# EAGLE board 24x16_RGB_ATXMega_Wifi_BBuck (EAGLE 6.5.0)
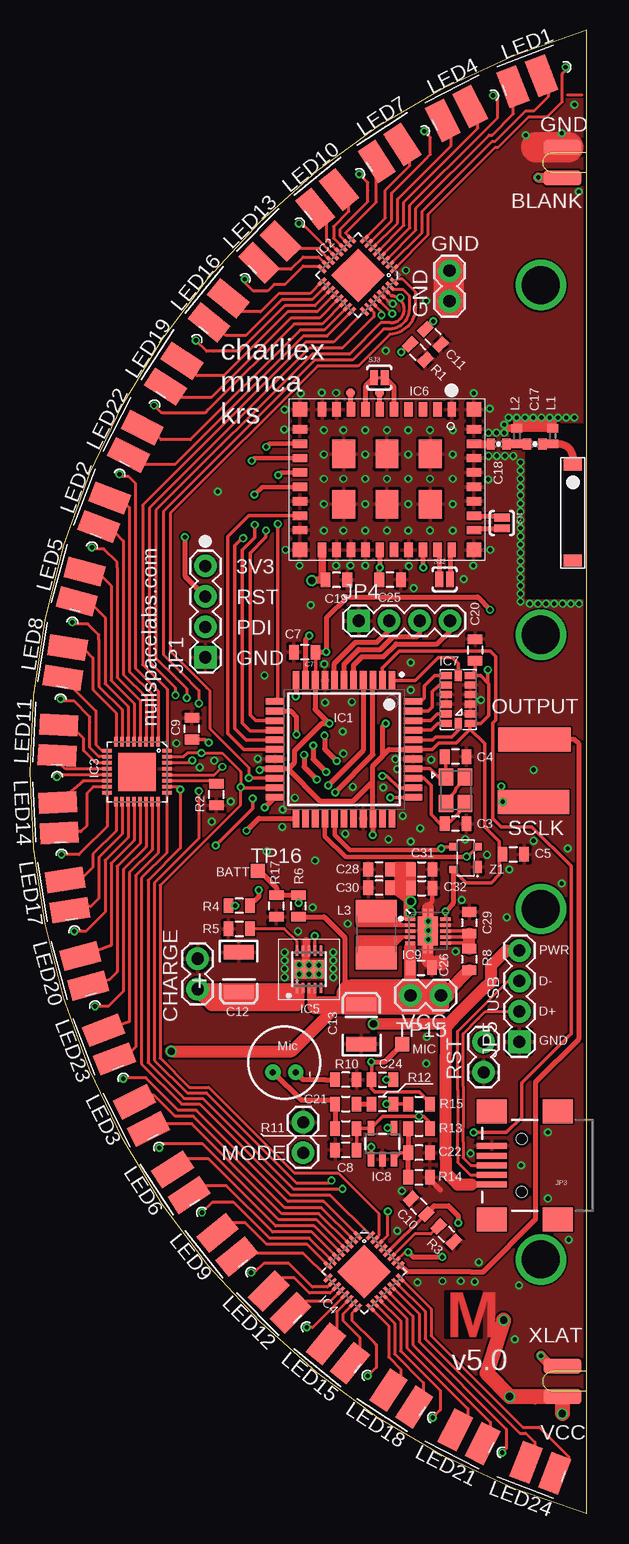
[diagram p8: board, top side]
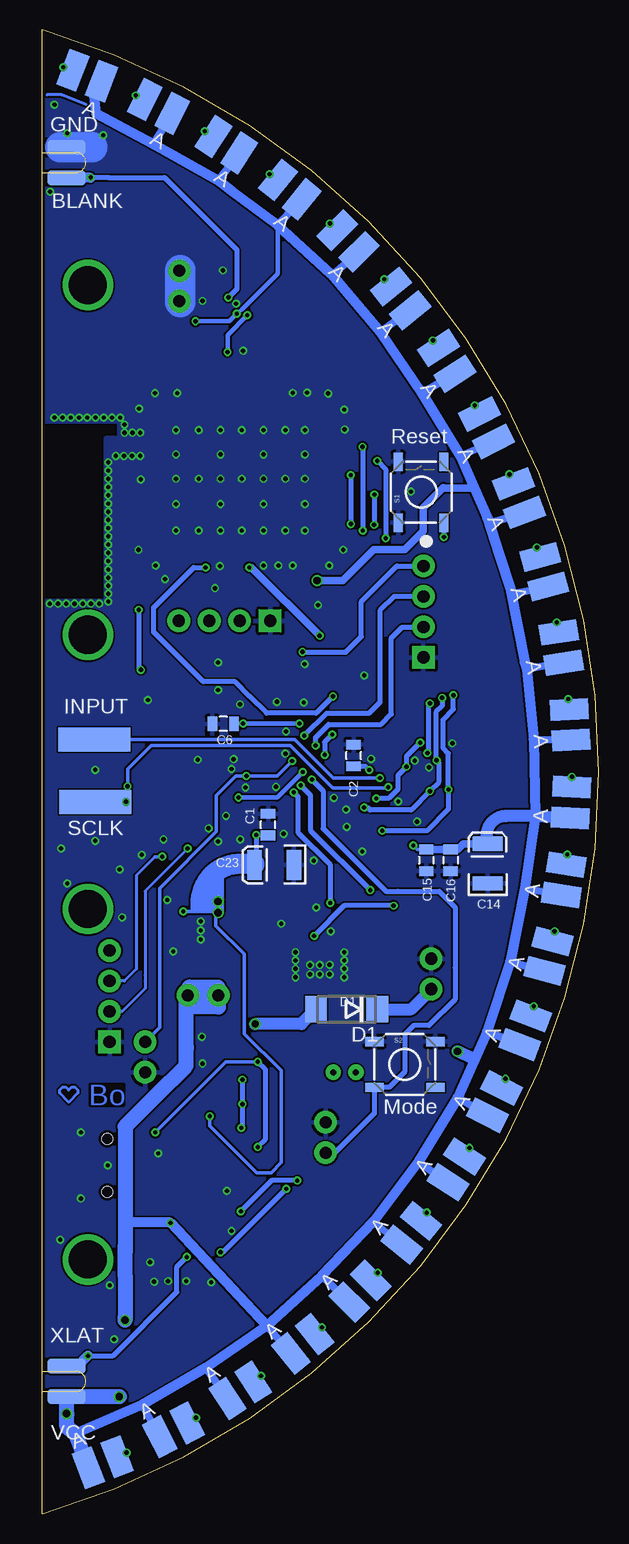
[diagram p9: board, bottom side, seen from below]

Size 46.39 x 123.7 mm. Coordinates in mm from the lower left corner, seen from the top.
Outline: 46.39,0 arc-147 46.39,123.7 46.39,0
Copper layers (1*16): Top 0.035mm / dielectric 1.5mm / Bottom 0.035mm
Design rules "ITEADstudio_DRC": minimum track width 6mil, minimum drill 12mil, track to track 6mil, track to pad 6mil, pad to pad 6mil, via to via 6mil, smd to smd 0mil, copper to edge 10mil, drill to drill 10mil, minimum pad ring 10mil, minimum via ring 6mil, stop-mask expansion 2mil, vias tented up to drill 100mil, thermal gap 10mil

## Footprints (pad centres in the part's own frame; a part is rotated, then mirrored left to right if it is on the bottom)
AT8010 = smd 1 x 1.5: P$1 4,0; P$2 -4,0
0805 = smd 0.8 x 1.2: 1 -0.9,0; 2 0.9,0
EIA3528 = smd 1.2 x 2.5: A 1.65,0; C -1.65,0
0402-CAP = smd 0.7 x 0.9: 1 -0.65,0; 2 0.65,0
1X02 = drill 1.016 pad 1.88: 1 0,0; 2 2.54,0
DO214AA = smd 1.8 x 2.2: A 2.55,0; C -2.55,0
NONOLITH_TQFP-44 = smd 1.55 x 0.55: 1 -5.75,4; 2 -5.75,3.2; 3 -5.75,2.4; 4 -5.75,1.6; 5 -5.75,0.8; 6 -5.75,0; 7 -5.75,-0.8; 8 -5.75,-1.6; 9 -5.75,-2.4; 10 -5.75,-3.2; 11 -5.75,-4; 23 5.75,-4; 24 5.75,-3.2; 25 5.75,-2.4; 26 5.75,-1.6; 27 5.75,-0.8; 28 5.75,0; 29 5.75,0.8; 30 5.75,1.6; 31 5.75,2.4; 32 5.75,3.2; 33 5.75,4 | smd 0.55 x 1.55: 12 -4,-5.75; 13 -3.2,-5.75; 14 -2.4,-5.75; 15 -1.6,-5.75; 16 -0.8,-5.75; 17 0,-5.75; 18 0.8,-5.75; 19 1.6,-5.75; 20 2.4,-5.75; 21 3.2,-5.75; 22 4,-5.75; 34 4,5.75; 35 3.2,5.75; 36 2.4,5.75; 37 1.6,5.75; 38 0.8,5.75; 39 0,5.75; 40 -0.8,5.75; 41 -1.6,5.75; 42 -2.4,5.75; 43 -3.2,5.75; 44 -4,5.75
QFN32_XLP = smd 0.285 x 0.8: 1 -1.75,-2.5; 2 -1.25,-2.5; 3 -0.75,-2.5; 4 -0.25,-2.5; 5 0.25,-2.5; 6 0.75,-2.5; 7 1.25,-2.5; 8 1.75,-2.5; 17 1.75,2.5; 18 1.25,2.5; 19 0.75,2.5; 20 0.25,2.5; 21 -0.25,2.5; 22 -0.75,2.5; 23 -1.25,2.5; 24 -1.75,2.5 | smd 0.8 x 0.285: 9 2.5,-1.75; 10 2.5,-1.25; 11 2.5,-0.75; 12 2.5,-0.25; 13 2.5,0.25; 14 2.5,0.75; 15 2.5,1.25; 16 2.5,1.75; 25 -2.5,1.75; 26 -2.5,1.25; 27 -2.5,0.75; 28 -2.5,0.25; 29 -2.5,-0.25; 30 -2.5,-0.75; 31 -2.5,-1.25; 32 -2.5,-1.75 | smd 3.15 x 3.15: EP 0,0
DFN10_3X3 = smd 0.3 x 0.85: 1 -1,-1.55; 2 -0.5,-1.55; 3 0,-1.55; 4 0.5,-1.55; 5 1,-1.55; 6 1,1.55; 7 0.5,1.55; 8 0,1.55; 9 -0.5,1.55; 10 -1,1.55 | smd 2.48 x 1.55: EXP 0,0
CC3000 = smd 1.2 x 0.7: P$1 0.9,13.55; P$2 0.9,12.35; P$3 0.9,11.15; P$4 0.9,9.95; P$5 0.9,8.75; P$6 0.9,7.55; P$7 0.9,6.35; P$8 0.9,5.15; P$9 0.9,3.95; P$10 0.9,2.75; P$19 12.6,2.75; P$20 12.6,3.95; P$21 12.6,5.15; P$22 12.6,6.35; P$23 12.6,7.55; P$24 12.6,8.75; P$25 12.6,9.95; P$26 12.6,11.15; P$27 12.6,12.35; P$28 12.6,13.55 | smd 0.7 x 1.2: P$11 2.55,0.9; P$12 3.75,0.9; P$13 4.95,0.9; P$14 6.15,0.9; P$15 7.35,0.9; P$16 8.55,0.9; P$17 9.75,0.9; P$18 10.95,0.9; P$29 10.95,15.4; P$30 9.75,15.4; P$31 8.55,15.4; P$32 7.35,15.4; P$33 6.15,15.4; P$34 4.95,15.4; P$35 3.75,15.4; P$36 2.55,15.4 | smd 2.4 x 1.9: P$37 4.6,11.75; P$38 4.6,8.15; P$39 4.6,4.55; P$40 8.8,11.75; P$41 8.8,8.15; P$42 8.8,4.55 | smd 1.2 x 1.2: P$43 0.9,15.4; P$44 0.9,0.9; P$45 12.6,0.9; P$46 12.6,15.4
LGA-14 = smd 0.6 x 0.9: 1 -2,-1; 2 -1.2,-1; 3 -0.4,-1; 4 0.4,-1; 5 1.2,-1; 6 2,-1; 8 2,1; 9 1.2,1; 10 0.4,1; 11 -0.4,1; 12 -1.2,1; 13 -2,1 | smd 0.9 x 0.6: 7 2,0; 14 -2,0
SOT23-5 = smd 0.55 x 1.2: 1 -0.95,-1.3; 2 0,-1.3; 3 0.95,-1.3; 4 0.95,1.3; 5 -0.95,1.3
QFN_10_PAD = smd 0.297 x 0.85: 1 -1,-1.475; 2 -0.5,-1.475; 3 0,-1.475; 4 0.5,-1.475; 5 1,-1.475; 6 1,1.475; 7 0.5,1.475; 8 0,1.475; 9 -0.5,1.475; 10 -1,1.475 | smd 2.4 x 1.65: PAD@1 0,0 | smd 0.7 x 0.28: PAD@2 -1.5,0.25; PAD@3 -1.5,-0.25; PAD@4 1.5,0.25; PAD@5 1.5,-0.25
1X04 = drill 1.016 pad 1.88 square: 1 0,0 | drill 1.016 pad 1.88: 2 2.54,0; 3 5.08,0; 4 7.62,0
USB-MINIB = smd 2.5 x 0.5: D+ 2.5,0; D- 2.5,0.8; GND 2.5,-1.6; ID 2.5,-0.8; VBUS 2.5,1.6 | smd 2.5 x 2: MTN1 -3,4.5; MTN2 2.5,4.5; MTN3 -3,-4.5; MTN4 2.5,-4.5 | hole 0.9: 0,2.2; 0,-2.2
C0402 = smd 0.7 x 0.9: 1 -0.65,0; 2 0.65,0
L1812 = smd 1.9 x 3.4: 1 -1.95,0; 2 1.95,0
LED5MM_RGB_EDGE = smd 1.75 x 3.175 bottom: A -0.585,-1.6; B 1.971,-1.6 | smd 1.75 x 3.175: G 0.693,-1.6; R -1.863,-1.6
MIC-6MM = drill 0.5 pad 1.27: 1 -0.8,0.95; 2 -0.8,-0.95
TACTILE_SWITCH_SMD = smd 1.524 x 0.762: 1 -2.54,1.905; 2 2.54,1.905; 3 -2.54,-1.905; 4 2.54,-1.905
SJ_2S-NO = smd 0.635 x 1.27: 1 -0.45,0; 2 0.45,0
SLOT = smd 3.175 x 1.27: P$1 2.032,1.27; P$2 2.032,-1.27 | smd 3.175 x 1.27 bottom: P$3 2.032,1.27; P$4 2.032,-1.27
TP20SQ = smd 2 x 2: TP 0,0
SPARKFUN_PAD.03X.03 = smd 0.762 x 0.762: P$1 0,0
TP12SQ = smd 1.2 x 1.2: TP 0,0
NX3225GA = smd 1.4 x 1.2: 1 -1.1,-0.8; 2 1.1,-0.8; 3 1.1,0.8; 4 -1.1,0.8
SOT143B = smd 1 x 0.7: 1 -0.75,-1 | smd 0.6 x 0.7: 2 0.95,-1; 3 0.95,1; 4 -0.95,1

## Placement (x,y rotation side)
ANT  AT8010  [AT8010]  45.24,83.46 90 top
C1  .1uF  [0805]  27.57,57.45 90 bottom
C2  .1uF  [0805]  20.43,63.22 90 bottom
C3  10pF  [0805]  35.46,57.53 180 top
C4  10pF  [0805]  35.46,63.12 180 top
C5  .1uF  [0805]  40.28,54.98 0 top
C6  .1uF  [0805]  31.3,65.86 180 bottom
C7  .1uF  [0805]  22.89,71.83 180 top
C8  0.1uF  [0805]  26.32,30.33 180 top
C9  .1uF  [0805]  13.49,65.46 90 top
C10  .1uF  [0805]  32.39,25.63 135 top
C11  .1uF  [0805]  33.58,98.13 315 top
C12  4.7uF  [EIA3528]  17.41,45.16 270 top
C13  4.7uF  [EIA3528]  27.62,40.82 90 top
C14  47uF  [EIA3528]  9.28,54.2 90 bottom
C15  10uF  [0805]  14.38,54.48 270 bottom
C16  1uF  [0805]  12.35,54.48 270 bottom
C17  2.2pF  [0402-CAP]  42.07,89.18 180 top
C18  10pF  [0402-CAP]  39.05,89.18 180 top
C19  1uF  [0805]  25.53,77.85 180 top
C20  0.1uF  [0805]  37.09,72.01 270 top
C21  4.7uF  [0805]  26.32,34.16 0 top
C22  1uF  [0805]  32.42,30.1 180 top
C23  47uF  [EIA3528]  27.06,54.1 180 bottom
C24  12pF  [0805]  29.37,36.19 0 top
C25  1uF  [0805]  30,77.88 180 top
C26  10uF  [0805]  32.59,45.52 0 top
C28  10uF  [0805]  29.09,53.72 180 top
C29  0.1  [0805]  36.61,49.28 270 top
C30  10uF  [0805]  29.09,52.2 180 top
C31  12pF  [0805]  32.65,53.72 0 top
C32  1uF  [0805]  32.65,52.17 0 top
CHARGE  [1X02]  13.98,46.28 270 top
D1  SSB44-E3/52T  [DO214AA]  21.01,42.06 180 bottom
GND  [1X02]  34.96,101.09 90 top
IC1  [NONOLITH_TQFP-44]  26.17,63.73 270 top
IC2  TLC5947XLP  [QFN32_XLP]  27.34,103.25 135 top
IC3  TLC5947XLP  [QFN32_XLP]  8.92,61.85 180 top
IC4  TLC5947XLP  [QFN32_XLP]  27.84,20.19 225 top
IC5  MCP73123  [DFN10_3X3]  23.25,45.39 0 top
IC6  CC3000  [CC3000]  21.6,92.96 270 top
IC7  MMA7455L  [LGA-14]  35.69,67.89 90 top
IC8  OPA344  [SOT23-5]  29.37,30.86 0 top
IC9  TPS6300X  [QFN_10_PAD]  33.15,48.59 270 top
JP1  [1X04]  14.61,71.4 90 top
JP3  USBSMD  [USB-MINIB]  40.98,29.06 180 top
JP4  [1X04]  27.39,74.45 0 top
JP5  [1X04]  40.77,39.34 90 top
L1  NL  [C0402]  43.57,89.84 270 top
L2  2.2nH  [C0402]  40.57,89.84 270 top
L3  [L1812]  28.86,48.29 90 top
LED1  GM1WA55311A5MM_RGB_EDGE  [LED5MM_RGB_EDGE]  41.41,121.13 21 top
LED2  GM1WA55311A5MM_RGB_EDGE  [LED5MM_RGB_EDGE]  4.91,84.6 69 top
LED3  GM1WA55311A5MM_RGB_EDGE  [LED5MM_RGB_EDGE]  7.59,33.02 117 top
LED4  GM1WA55311A5MM_RGB_EDGE  [LED5MM_RGB_EDGE]  35.34,118.43 27 top
LED5  GM1WA55311A5MM_RGB_EDGE  [LED5MM_RGB_EDGE]  2.83,78.28 75 top
LED6  GM1WA55311A5MM_RGB_EDGE  [LED5MM_RGB_EDGE]  10.91,27.26 123 top
LED7  GM1WA55311A5MM_RGB_EDGE  [LED5MM_RGB_EDGE]  29.58,115.11 33 top
LED8  GM1WA55311A5MM_RGB_EDGE  [LED5MM_RGB_EDGE]  1.45,71.78 81 top
LED9  GM1WA55311A5MM_RGB_EDGE  [LED5MM_RGB_EDGE]  14.82,21.89 129 top
LED10  GM1WA55311A5MM_RGB_EDGE  [LED5MM_RGB_EDGE]  24.21,111.2 39 top
LED11  GM1WA55311A5MM_RGB_EDGE  [LED5MM_RGB_EDGE]  0.75,65.17 87 top
LED12  GM1WA55311A5MM_RGB_EDGE  [LED5MM_RGB_EDGE]  19.26,16.95 135 top
LED13  GM1WA55311A5MM_RGB_EDGE  [LED5MM_RGB_EDGE]  19.26,106.75 45 top
LED14  GM1WA55311A5MM_RGB_EDGE  [LED5MM_RGB_EDGE]  0.75,58.53 93 top
LED15  GM1WA55311A5MM_RGB_EDGE  [LED5MM_RGB_EDGE]  24.21,12.5 141 top
LED16  GM1WA55311A5MM_RGB_EDGE  [LED5MM_RGB_EDGE]  14.84,101.79 51 top
LED17  GM1WA55311A5MM_RGB_EDGE  [LED5MM_RGB_EDGE]  1.45,51.92 99 top
LED18  GM1WA55311A5MM_RGB_EDGE  [LED5MM_RGB_EDGE]  29.58,8.59 147 top
LED19  GM1WA55311A5MM_RGB_EDGE  [LED5MM_RGB_EDGE]  10.96,96.41 57 top
LED20  GM1WA55311A5MM_RGB_EDGE  [LED5MM_RGB_EDGE]  2.83,45.42 105 top
LED21  GM1WA55311A5MM_RGB_EDGE  [LED5MM_RGB_EDGE]  35.34,5.27 153 top
LED22  GM1WA55311A5MM_RGB_EDGE  [LED5MM_RGB_EDGE]  7.61,90.65 63 top
LED23  GM1WA55311A5MM_RGB_EDGE  [LED5MM_RGB_EDGE]  4.88,39.09 111 top
LED24  GM1WA55311A5MM_RGB_EDGE  [LED5MM_RGB_EDGE]  41.41,2.57 159 top
MIC1  MIC6MM  [MIC-6MM]  21.19,37.62 90 top
MODE  [1X02]  22.76,32.64 270 top
R1  20K  [0805]  32.32,96.85 135 top
R2  20K  [0805]  15.53,59.97 90 top
R3  20K  [0805]  34.69,23.32 135 top
R4  1K  [0805]  17.43,50.7 180 top
R5  1K  [0805]  17.43,48.77 0 top
R6  100K  [0805]  22.36,50.67 90 top
R8  100R  [0805]  36.61,46.23 270 top
R10  4.7k  [0805]  26.32,36.19 180 top
R11  2.2k  [0805]  26.32,32.13 0 top
R12  10k  [0805]  29.37,34.16 180 top
R13  10k  [0805]  32.42,32.13 0 top
R14  10k  [0805]  32.42,28.07 0 top
R15  1M  [0805]  32.42,34.16 0 top
R17  100K  [0805]  20.53,50.67 90 top
RST  [1X02]  37.8,36.8 90 top
S1  [TACTILE_SWITCH_SMD]  14.81,85.17 90 bottom
S2  [TACTILE_SWITCH_SMD]  16.16,37.46 0 bottom
SJ1  SOLDERJUMPERNO  [SJ_2S-NO]  39.33,82.6 270 top
SJ2  SOLDERJUMPERNO  [SJ_2S-NO]  34.55,77.9 0 top
SJ3  SOLDERJUMPERNO  [SJ_2S-NO]  29.11,94.72 0 top
SLOT1  SLOT  [SLOT]  46.39,11.05 180 top
SLOT2  SLOT  [SLOT]  46.39,112.65 180 top
TP1  TPTP20SQ  [TP20SQ]  42.04,64.57 0 top
TP2  TPTP20SQ  [TP20SQ]  40.04,64.57 0 top
TP3  TPTP20SQ  [TP20SQ]  41.97,59.36 0 top
TP4  TPTP20SQ  [TP20SQ]  39.99,59.36 0 bottom
TP5  TPTP20SQ  [TP20SQ]  42.04,64.57 0 bottom
TP6  TPTP20SQ  [TP20SQ]  40.04,64.57 0 bottom
TP7  TPTP20SQ  [TP20SQ]  43.97,59.36 0 bottom
TP8  TPTP20SQ  [TP20SQ]  41.99,59.36 0 bottom
TP9  TPTP20SQ  [TP20SQ]  44.05,64.57 0 top
TP10  TPTP20SQ  [TP20SQ]  39.99,59.36 0 top
TP11  TPTP20SQ  [TP20SQ]  44.05,64.57 0 bottom
TP12  TPTP20SQ  [TP20SQ]  43.95,59.36 0 top
TP13  SPARKFUN_TEST-POINT3  [SPARKFUN_PAD.03X.03]  29.14,93.45 0 top
TP14  SPARKFUN_TEST-POINT3  [SPARKFUN_PAD.03X.03]  26.73,93.45 0 top
TP15  MIC  [TP12SQ]  31.02,39.14 0 top
TP16  BATT  [TP12SQ]  18.98,53.59 0 top
VCC  [1X02]  31.71,43.23 0 top
X1  NX3225GA-16.000M-STD-CRG-2  [NX3225GA]  35.46,60.32 270 top
Z1  PRTR5V0U2X  [SOT143B]  36.3,54.66 90 top

## Tracks (layer width: path | path; a pad name or v marks a point on that pad's centre or on a via)
!CS
  Top 0.305: IC7.7 35.67,69.92 35.67,70.89 35.19,71.37 34.02,71.37 32.12,69.48 IC1.1
+3V3  (via drill 0.36, 0.61)
  Top 0.254: C28.1 30.46,53.99 | 30.46,53.99 30.46,54.25 | 30.46,54.25 30.46,53.99 | 30.46,53.99 30.46,52.17 C30.1 | 30.46,53.99 30.46,54.25 | 30.46,54.25 32.01,54.25 32.01,52.17 C32.1 | 30.46,53.99 30.46,53.03 30.69,53.03 31.81,53.03 31.81,53.26 31.17,53.26
  Top 0.305: C7.1 23.77,71.81 | 36.66,65.84 36.66,65.38 35.54,64.26 34.07,64.26 33.53,63.73 IC1.39 | 36.66,65.84 36.66,65.86 IC7.1 37.58,65.89 38.23,66.55 38.23,69.19 38.21,69.22 | IC7.6 | 35.24,53.64 Z1.4 35.3,53.67 35.29,53.67 36.35,52.6 38.44,52.6 39.12,53.29 39.12,55.52 | IC1.19 | IC1.9 23.79,69.5 C7.1 | 23.82,71.86 C7.1 | 38.21,69.22 37.55,69.88 36.71,69.88 IC7.6 | C20.2 37.09,70.29 IC7.6 | v32.42,33.15 29.4,33.15 IC8.5 arc-90 28.39,32.13 R11.2 C8.1 | v32.42,33.15 32.8,33.15 | 32.8,33.15 33.32,32.63 R13.2 | 32.8,33.15 v32.42,33.15 | 39.12,55.52 39.12,56.03 37.88,57.28 37.88,64.21 36.66,65.43 36.66,65.84 | C5.1 39.12,55.23 39.12,55.52 | 29.39,63.22 29.39,63.17 | v38.16,70.36 38.16,69.27 38.21,69.22 | v24.69,71.86 24.72,71.86 24.75,71.86 | IC9.1 31.91,49.59 | 31.32,49.59 IC9.1 | IC9.1 31.27,49.59 31.27,50.37 | 31.27,50.37 31.27,51.08 30.49,51.69 30.49,52.81 32.01,52.81 31.93,52.73 | 31.93,49.71 31.73,49.91 v31.73,50.11 | v31.73,50.11 v31.73,51.05 31.73,51.59 31.53,51.38 31.53,49.78 31.4,49.78 31.4,52.58 31.2,52.58 30.87,53.39 | 30.87,52.2 31.1,51.31 31.38,51.77 30.73,51.56 C30.1 | IC9.10 34.63,49.96 v34.63,50.22 | v31.73,50.11 31.55,50.09 31.27,50.37
  Top 0.406: 23.79,72.2 C7.1 23.79,72.17 | 29.39,63.22 29.39,63.17 28.57,62.34 IC1.31 28.57,56.6 v28.56,56.59 | 29.39,63.22 29.39,64.24 29.39,65.41 29.39,65.63 v29.65,65.89 | 28.39,32.13 IC8.5 | IC1.9 23.77,67.07 v24.95,65.89 24.31,65.89 22.05,63.63 22.05,62.64 21.55,62.13 21.47,62.13 | IC1.19 21.47,62.13 | 20.83,62.1 20.86,62.13 21.47,62.13 | 21.47,62.13 24.16,59.44 26.96,59.44 28.56,61.04 28.56,61.34 | 35.26,53.8 35.26,50.9 v34.63,50.22 | 23.82,71.86 v24.69,71.86 | v24.69,71.86 24.72,71.86 v24.69,71.86 | 24.75,71.86 24.75,74.75 26.42,76.43 37.29,76.43 38.36,75.36 | v19.13,62 19.26,62.13 IC1.19 | 29.39,63.22 29.9,63.73 IC1.39
  Top 0.813: C28.1 C31.1
  Top 1.016: 30.87,53.39 30.87,52.2
  Bottom 0.254: 32.14,50.34 32.04,50.34 | 32.04,50.34 31.98,50.34 31.98,50.55 | 32.04,50.22 32.04,50.34
  Bottom 0.305: C6.1 30.17,65.89 v29.65,65.89 | 24.67,71.83 v24.69,71.86 | v32.42,33.15 32.42,32.36 28.5,28.45 27.31,28.45 26.47,29.29 26.47,35.53 26.47,36.96 29.55,40.03 29.55,46.66 31.91,49.02 31.91,50.06 v31.73,50.11 31.86,50.22 31.38,50.22 31.38,53.36 32.01,53.36 | v28.56,56.59 28.52,56.55 C1.1 | 28.56,53.9 28.56,53.95 C23.A | v34.63,50.22 33.89,50.22 | 33.89,50.22 33.56,50.22 | 33.2,50.9 33.2,50.57 arc90 33.56,50.22 | 32.01,50.19 31.58,50.19 31.58,52.7 31.81,52.7 31.81,50.44 32.04,50.22 33.56,50.22 | 32.44,50.77 33.89,50.77 33.89,50.8 33.89,50.22
  Bottom 0.356: v24.95,65.89 v29.65,65.89
  Bottom 0.406: v28.56,56.59 28.56,53.9 | v38.33,75.36 38.33,70.54 v38.16,70.36 | 24.67,71.83 21.09,71.83 19.79,73.13 19.79,76.05 16.82,79.02 JP1.4 | v19.13,62 19.45,62.32 C2.1
  Bottom 0.61: 28.71,53.75 C23.A
  Bottom 1.016: 32.01,53.36 32.44,52.93 32.44,50.77
  Bottom 1.676: C23.A 28.71,54.18 29.5,54.18 29.93,54.18 arc-90 33.2,50.9
BATTSENSE  (via drill 0.36)
  Top 0.305: R6.2 22.36,50.95 v22.38,50.93
  Top 0.406: TP16.TP 19.13,53.59 20.55,52.17 20.55,51.6 R17.2 R6.2 | v25.43,60.15 28.57,63.28 IC1.3
  Bottom 0.305: v22.38,50.93 22.46,51
  Bottom 0.406: v25.43,60.15 25.08,59.79 25.08,56.82 22.38,54.13 v22.38,50.93
BLANK  (via drill 0.36)
  Top 0.254: v13.52,62.81 13.4,62.6 IC3.30 | v25.13,27.79 24.95,27.61 22.18,27.61 14.69,35.1 13.09,35.1 10.37,37.82 10.37,52.6 14.08,56.31 v14.08,60.25 | 30.1,101.55 30.11,101.55 arc-177 30.05,99.29 29.24,99.29 26.63,96.67 23.5,96.67 10.5,83.67 10.5,71.35 12.22,69.62 13.06,68.78 v13.06,68.02 | 30.1,101.55 IC2.30 | 30.1,101.55 30.1,101.57 v30.87,101.4 | 44.33,111.4 SLOT2.P$3 | IC4.30 29.83,23.23 v29.83,25.22
  Top 0.305: IC1.22 20.44,59.73
  Top 0.406: v19.56,58.88 IC1.22
  Top 0.813: v42.35,111.4 44.33,111.4
  Bottom 0.254: v42.35,111.4 42.37,111.38
  Bottom 0.406: v42.35,111.4 40.87,111.4 36.18,111.4 30.16,105.38 30.16,102.11 v30.87,101.4 | v25.13,27.79 27.26,27.79 v29.83,25.22 | v13.06,68.02 13.06,67.33 13.57,66.83 13.57,62.86 v13.52,62.81 13.32,62.61 13.32,62.33 13.32,61.01 v14.08,60.25 15.65,58.67 19.06,58.67 19.26,58.88 v19.56,58.88
  Bottom 0.813: 42.37,111.38 SLOT2.P$3
BUTTON  (via drill 0.36)
  Top 0.406: v22.84,63.27 22.84,62.28 v23.91,61.21 | IC1.13 21.72,66.93 22.21,66.45 v22.21,64.97
  Bottom 0.254: 18.65,35.46 S2.3
  Bottom 0.406: v23.91,61.21 22.97,60.27 22.97,57.12 22.23,56.39 17.74,51.89 16.74,51.89 13.29,51.89 11.97,50.57 11.97,45.52 11.97,42.9 14.15,40.72 15.42,40.72 16.19,39.95 16.19,36.83 17.46,35.56 S2.3 18.7,33.38 22,30.07 22.74,30.07 MODE.2 | v22.21,64.97 22.84,64.34 v22.84,63.27
CHARGE
  Top 0.254: IC5.1 21.89,43.49 21.8,43.49 | 21.8,43.49 C12.A | 22.1,44.09 22.79,44.09 22.79,43.48 21.8,43.48 21.8,43.49 | 21.8,43.49 21.8,43.59
  Top 0.305: IC5.2 IC5.1 22.25,43.76
  Top 0.813: 22.15,43.74 IC5.1
  Top 1.27: CHARGE.2 15.17,42.55 22.26,42.55 22.26,43.28 21.93,43.61 14.31,43.61 14.41,43.51 C12.A
  Bottom 1.016: 13.98,43.51 CHARGE.2 15.65,42.06 D1.C
COL1  (via drill 0.36)
  Top 0.254: IC2.1 33.18,106.62 33.18,108.33 38.77,113.92 39.02,113.92 41.56,116.46 42.83,116.46 43.11,116.46 44.35,117.7 44.35,120.04 44.63,120.32 v44.63,120.6
  Bottom 0.305: LED1.B 44.1,120.07 v44.63,120.6
COL2
  Top 0.254: IC2.2 32.67,106.82 32.67,108.58 38.51,114.43 38.77,114.43 41.31,116.97 42.02,116.97 43.21,118.16 43.21,119.31 LED1.G
COL3
  Top 0.254: IC2.3 32.16,107.02 32.16,108.84 38.26,114.94 38.51,114.94 40.29,116.71 40.29,118.75 LED1.R
COL4  (via drill 0.36)
  Top 0.254: IC2.4 31.65,107.22 31.65,109.09 37.67,115.09 38.97,116.38 38.97,117.6 38.97,117.86 v38.59,118.24
  Bottom 0.254: LED4.B arc-90 38.46,117.25 38.46,118.11 v38.59,118.24
COL5
  Top 0.254: IC2.5 31.15,107.41 31.15,109.35 37.32,115.52 37.32,116.15 36.68,116.79 LED4.G
COL6
  Top 0.254: IC2.6 30.64,107.61 30.64,109.6 35.08,114.05 35.08,114.96 34.4,115.64 LED4.R
COL7  (via drill 0.36)
  Top 0.254: IC2.7 30.13,107.81 30.13,110.11 32.92,112.9 33.36,113.33 33.36,114.76 v32.85,115.26
  Bottom 0.254: LED7.B 32.11,114.36 v32.85,115.26
COL8
  Top 0.254: IC2.8 29.62,108.01 29.62,110.36 31.65,112.39 31.65,113.06 31.5,113.21 31.5,113.67 LED7.G
COL9
  Top 0.254: IC2.9 26.32,106.74 26.32,106.81 28.86,109.35 28.86,112.39 LED7.R
COL10  (via drill 0.36)
  Top 0.254: IC2.10 25.81,106.54 25.81,107.06 27.59,108.84 28.15,109.4 28.15,110.31 28.15,110.97 v27.44,111.68
  Bottom 0.254: 26.74,110.88 LED10.B 26.95,111.19 v27.44,111.68 27.59,110.03
COL11
  Top 0.254: IC2.11 25.3,106.34 25.3,107.31 26.57,108.58 26.57,109.09 25.51,110.16 LED10.G
COL12
  Top 0.254: IC2.12 24.72,106.22 24.72,107.83 LED10.R
COL13  (via drill 0.36)
  Top 0.254: IC2.13 22.92,107.31 v22.41,107.57
  Bottom 0.254: LED13.B v22.41,107.57
COL14
  Top 0.254: IC2.14 24.07,105.46 21.9,105.46 21.25,106.11 LED13.G
COL15
  Top 0.254: IC2.15 24.04,104.78 22.76,104.78 21.75,103.76 20.05,103.76 19.5,104.3 LED13.R
COL16  (via drill 0.36)
  Top 0.254: IC2.16 24.1,104.01 22.76,104.01 21.24,102.49 20.35,102.49 19.79,101.93 18.6,101.93 17.89,102.64 v17.89,102.92
  Bottom 0.254: LED16.B 17.51,102.31 v17.89,102.92
COL17
  Top 0.254: IC2.17 23.34,101.73 20.73,101.73 19.21,100.2 17.43,100.2 16.53,101.1 LED16.G
COL18
  Top 0.254: IC2.18 23.54,101.22 20.99,101.22 17.99,98.22 16.31,98.22 15.2,99.33 LED16.R
COL19  (via drill 0.36)
  Top 0.254: IC2.19 23.74,100.71 21.24,100.71 17.94,97.41 17.46,96.93 15.27,96.93 14.71,96.93 v13.82,97.81
  Bottom 0.254: LED19.B 13.6,97.41 v13.82,97.81
COL20
  Top 0.254: IC2.20 23.94,100.2 21.49,100.2 16.16,94.87 13.93,94.87 LED19.G 12.86,95.88
COL21
  Top 0.254: IC2.21 24.13,99.69 21.75,99.69 15.12,93.07 12.66,93.07 11.75,93.97 LED19.R
COL22  (via drill 0.36)
  Top 0.254: IC2.22 24.33,99.19 22,99.19 14.89,92.07 14.59,91.77 11.46,91.77 10.98,91.77 v10.34,92.41
  Bottom 0.254: LED22.B 10.43,91.68 arc90 v10.34,92.41
COL23
  Top 0.254: IC2.23 24.53,98.68 22.51,98.68 13.37,89.53 10.93,89.53 10.55,89.92 9.98,89.92 LED22.G 10.07,90.29
COL24
  Top 0.254: IC2.24 24.73,98.17 22.76,98.17 12.07,87.48 8.98,87.48 LED22.R
COL25  (via drill 0.36)
  Top 0.254: IC3.1 10.67,68.61 8.79,70.48 8.79,85.9 8.21,86.49 7.63,86.49 v7.45,86.66
  Bottom 0.254: LED2.B 7.59,85.87 arc90 v7.45,86.66
COL26
  Top 0.254: IC3.2 10.17,68.35 8.29,70.23 8.29,83.9 7.91,84.28 7.05,84.28 LED2.G
COL27
  Top 0.254: IC3.3 9.67,68.08 7.78,69.98 7.78,81.1 7.04,81.84 6.19,81.84 LED2.R
COL28  (via drill 0.36)
  Top 0.254: IC3.4 9.17,67.82 7.27,69.72 7.27,78.89 7.27,79.32 6.15,80.44 5.29,80.44 v5.16,80.57
  Bottom 0.254: LED5.B 5.46,79.77 v5.16,80.57
COL29
  Top 0.254: IC3.5 8.67,67.56 6.76,69.47 6.76,77.37 6,78.13 4.96,78.13 LED5.G
COL30
  Top 0.254: IC3.6 8.17,67.3 6.25,69.22 6.25,74.73 5.26,75.72 4.25,75.72 LED5.R
COL31  (via drill 0.36)
  Top 0.254: IC3.7 7.67,67.04 5.75,68.96 5.75,72.85 5.75,73.28 4.83,74.19 3.64,74.19 v3.51,74.32
  Bottom 0.254: LED8.B 4.04,73.48 v3.51,74.32
COL32
  Top 0.254: IC3.8 7.17,66.77 5.24,68.71 5.24,71.35 4.55,72.03 3.32,72.03 LED8.G
COL33
  Top 0.254: IC3.9 6.03,63.6 5.49,64.13 5.49,66.93 2.85,69.57 LED8.R
COL34  (via drill 0.36)
  Top 0.254: IC3.10 6.4,63.12 5.75,63.12 4.98,63.88 4.98,65.99 4.98,66.45 3.69,67.74 2.72,67.74 v2.55,67.92
  Bottom 0.254: LED11.B 2.75,67.06 v2.55,67.92
COL35
  Top 0.254: LED11.G 2.44,65.41 3.71,65.41 4.48,64.64 4.48,63.63 5.5,62.6 IC3.11
COL36
  Top 0.254: IC3.12 2.95,62.1 2.29,62.76 LED11.R
COL37  (via drill 0.36)
  Top 0.254: IC3.13 2.95,61.59 2.39,61.59 v2.24,61.44
  Bottom 0.254: LED14.B 2.25,60.78 v2.24,61.44
COL38
  Top 0.254: 6.42,61.09 IC3.14 4.43,61.1 LED14.G
COL39
  Top 0.254: IC3.15 5.26,60.6 4.73,60.07 4.73,57.35 4.25,56.87 2.57,56.87 LED14.R
COL40  (via drill 0.36)
  Top 0.254: IC3.16 6.42,57.7 6.42,57.32 4.32,55.22 4.07,54.97 v2.62,54.97
  Bottom 0.254: LED17.B 2.72,54.35 v2.62,54.97
COL41
  Top 0.254: IC3.17 7.17,56.92 5.24,54.99 5.24,53.9 4.45,53.11 3.18,53.11 LED17.G 3.13,52.7
COL42
  Top 0.254: IC3.18 7.67,56.66 5.75,54.74 5.75,51.31 5.06,50.62 3.62,50.62 LED17.R
COL43  (via drill 0.36)
  Top 0.254: IC3.19 8.17,56.4 6.25,54.48 6.25,50.16 4.65,48.56 v3.69,48.56
  Bottom 0.254: LED20.B 3.87,48.31 v3.69,48.56
COL44
  Top 0.254: IC3.20 8.67,56.14 6.76,54.23 6.76,47.37 4.68,46.61 LED20.G
COL45
  Top 0.254: IC3.21 9.17,55.88 7.27,53.97 7.27,45.19 6.61,44.53 LED20.R
COL46  (via drill 0.36)
  Top 0.254: IC3.22 9.67,55.61 7.78,53.72 7.78,43.56 6.53,42.32 v5.42,42.32
  Bottom 0.254: LED23.B v5.42,42.32
COL47
  Top 0.254: IC3.23 10.17,55.35 8.29,53.47 8.29,41.02 LED23.G 6.73,40.51
COL48
  Top 0.254: IC3.24 10.67,55.09 8.79,53.21 8.79,38.91 8.24,38.35 7.47,38.35 LED23.R
COL49  (via drill 0.36)
  Top 0.254: IC4.1 24.48,26.03 21.49,26.03 13.87,33.66 12.35,33.66 9.66,36.35 7.85,36.35 v7.78,36.27
  Bottom 0.254: LED3.B 8.26,35.64 v7.78,36.27
COL50
  Top 0.254: IC4.2 24.28,25.53 21.24,25.53 13.62,33.15 12.1,33.15 10.34,34.9 9.56,34.9 9.02,34.36 LED3.G
COL51
  Top 0.254: IC4.3 24.08,25.02 20.99,25.02 13.49,32.51 10.95,32.51 10.53,32.09 LED3.R
COL52  (via drill 0.36)
  Top 0.254: IC4.4 23.88,24.51 20.73,24.51 14.56,30.68 14.38,30.86 11.54,30.86 11.13,30.86 v10.78,30.5
  Bottom 0.254: v10.78,30.5 11.36,29.79 LED6.B
COL53
  Top 0.254: IC4.5 23.68,24 20.48,24 14.89,29.59 13.06,29.59 12.19,28.72 LED6.G
COL54
  Top 0.254: IC4.6 23.48,23.49 20.22,23.49 16.36,27.36 14.33,27.36 13.55,26.57 LED6.R
COL55  (via drill 0.36)
  Top 0.254: IC4.7 23.28,22.99 19.97,22.99 17.81,25.15 17,25.96 15.17,25.96 v14.33,25.12
  Bottom 0.254: LED9.B 14.87,24.47 v14.33,25.12
COL56
  Top 0.254: IC4.8 23.08,22.48 19.72,22.48 17.94,24.26 16.92,24.26 15.86,23.19 LED9.G
COL57
  Top 0.254: IC4.9 22.78,21.72 17.18,21.72 17.23,21.66 LED9.R
COL58  (via drill 0.36)
  Top 0.254: IC4.10 24.81,18.92 23.53,18.92 21.55,20.9 19.49,20.9 18.7,20.12 v18.42,20.12
  Bottom 0.254: LED12.B v18.42,20.12
COL59
  Top 0.254: IC4.11 25.01,18.41 23.27,18.41 22,19.68 21.04,19.68 19.92,18.57 LED12.G 20.16,18.35
COL60
  Top 0.254: IC4.12 25,17.7 22.54,17.7 arc90 22.21,17.37 22.21,17.25 arc-90 LED12.R
COL61  (via drill 0.36)
  Top 0.254: IC4.13 23.55,15.54 v23.07,15.54
  Bottom 0.254: LED15.B 23.68,15.88 v23.07,15.54
COL62
  Top 0.254: IC4.14 25.56,16.85 25.56,15.11 24.91,14.47 LED15.G
COL63
  Top 0.254: IC4.15 26.07,16.65 26.07,16.13 27.49,14.71 27.49,13.31 26.75,12.57 LED15.R
COL64  (via drill 0.36)
  Top 0.254: IC4.16 26.83,16.7 26.83,16.13 28.63,14.33 28.86,14.1 28.86,12.57 28.86,12.22 v28.15,11.51
  Bottom 0.254: LED18.B 28.67,11.01 v28.15,11.51
COL65
  Top 0.254: IC4.17 29.88,15.69 29.88,13.08 30.89,12.06 30.89,11.3 30.13,10.54 LED18.G
COL66
  Top 0.254: IC4.18 30.38,15.88 30.38,13.33 32.77,10.95 32.77,10.08 32.02,9.33 LED18.R
COL67  (via drill 0.36)
  Top 0.254: IC4.19 30.89,16.08 30.89,13.59 34.19,10.29 34.19,8.66 v33.56,8.03
  Bottom 0.254: LED21.B 34.1,7.59 v33.56,8.03
COL68
  Top 0.254: IC4.20 31.4,16.28 31.4,13.84 36.48,8.76 36.48,8.25 35.72,7.5 LED21.G
COL69
  Top 0.254: IC4.21 31.91,16.48 31.91,14.1 38.36,7.64 38.36,6.91 37.72,6.27 LED21.R
COL70  (via drill 0.36)
  Top 0.254: IC4.22 32.42,16.68 32.42,14.35 39.66,7.11 39.71,7.06 39.71,5.82 39.71,5.46 v39.35,5.1
  Bottom 0.254: LED24.B 39.66,5.25 v39.35,5.1
COL71
  Top 0.254: IC4.23 32.92,16.88 32.92,14.6 40.8,6.73 41.31,6.73 42.07,5.97 42.07,5.46 41.62,5.02 LED24.G
COL72
  Top 0.254: IC4.24 33.43,17.08 33.43,14.86 41.05,7.24 42.42,7.24 44.43,5.23 44.89,4.77 44.89,4.42 43.86,3.39 LED24.R
D+  (via drill 0.36)
  Top 0.254: 25.41,57.94 IC1.27 | JP3.D+ 36.73,29.06 36.1,29.69 36.1,31.01 36.1,32.23 36.1,35.64 36.1,40.03 37.37,41.3 37.95,41.88 JP5.2
  Top 0.305: Z1.3 34.41,55.61 v34.27,55.47
  Top 0.356: 25.41,57.94 25.41,56.59 26.65,55.35 34.14,55.35 v34.27,55.47
  Bottom 0.254: v34.27,55.47 35.29,54.43 37.8,51.92 37.8,44.91 37.8,44.42 37.8,43.81 39.73,41.88 JP5.2
D-  (via drill 0.36)
  Top 0.254: IC1.26 | JP3.D- 38.46,28.27 36.68,28.27 35.64,29.31 35.64,30.53 35.64,32.03 35.64,35.38 35.64,40.23 39.83,44.42 JP5.3
  Top 0.305: Z1.2 36.48,54.79 v36.38,54.79
  Top 0.356: IC1.26 24.57,56.49 26.3,54.76 36.35,54.76 v36.38,54.79
  Bottom 0.254: 36.4,54.76 v36.38,54.79 | 37.01,54.76 38.54,53.24 38.54,45.41 39.53,44.42 JP5.3
  Bottom 0.305: 37.01,54.76 36.4,54.76
DAT  (via drill 0.36)
  Top 0.305: IC1.34 31.9,59.71 v30.03,59.71
  Top 0.406: v23.6,64.06 23.6,62.92 v24.67,61.85
  Bottom 0.356: v24.67,61.85 26.8,59.71 v30.03,59.71
  Bottom 0.406: v23.6,64.06 23.6,64.72 22.51,65.81 18.14,65.81 17.28,66.67 17.28,73.02 16.39,73.91 14.64,73.91 JP1.2
DGND
  Top 0.305: X1.2 34.66,59.32 35.13,59.92 35.39,60.17 35.54,60.5 36.26,61.3 X1.4
DOWN
  Top 0.406: IC1.7 25.37,70.9 27.13,72.67 28.91,72.67 29.93,73.69 JP4.2
GND  (via drill 0.36)
  Top 0.254: 23.02,47.78 23.02,47.21 arc-90 IC5.9 | v30.23,100.89 30.05,100.89 IC2.29 | 33.15,47.6 33.4,47.6 IC9.PAD@4 | IC9.PAD@3 33.15,50.09 33.15,50.27
  Top 0.305: 34.88,103.71 GND.2
  Top 0.356: 33.15,50.49 33.15,50.67 33.53,51.05 33.53,52.16 C32.2
  Top 0.406: R14.2 33.32,27.88 34.19,27 | 34.32,46.02 34.55,46.25
  Top 0.61: v23.25,45.74 22.97,46.02 22.97,46.46 23.02,46.51 23.02,47.78 | v40.57,91.39 L2.1 39.82,90.5 40.39,90.5 | 40.39,90.5 41.18,90.5 41.15,90.53 41,90.93 41.26,91.01 43.59,91.01 43.08,90.5 40.39,90.5 | 40.39,90.5 41.16,90.49 L1.1
  Top 1.016: 34.3,45.78 34.3,46 34.32,46.02 33.15,46.02 33.15,47.6 | 33.15,50.27 33.15,50.49 v33.18,48.64
  Top 2.54: 34.88,103.71 34.88,101.02 | 42.2,113.94 44.86,113.94
  Bottom 0.305: 34.88,103.68 GND.2
  Bottom 2.54: 34.88,103.68 34.88,100.99 | 42.2,113.94 44.86,113.94
  other vias: 15.14,57.71 15.35,62.79 22.43,45.77 24.06,45.75 22.43,44.98 23.25,44.98 24.06,44.98 44.3,115.09 37.57,67.84 30.44,62.92 24.59,67.64 31.07,58.19 26.27,56.69 34.37,19.41 37.4,20.98 33.03,37.54 26.83,67.69 26.07,65.23 26.91,60.6 40.93,29.06 37.07,19.35 40.39,14.55 45.37,117.47 41.31,114.94 31.32,103.66 29.65,96.95 22.08,59.69 33.08,39.78 29.88,56.24 33.18,49.4 33.18,47.88 21.01,57.28 30.99,26.92 30.61,23.6 29.9,67.49 31.73,68.68 33.03,101.12 25.28,46.81 25.28,46.13 25.28,45.44 25.28,44.73 21.22,44.73 21.22,45.44 21.22,46.13 21.22,46.81 22.33,48.56 40.75,19.05 44.89,22.86 19.72,55.22 14.15,62.23 26.12,63.37 30.61,62.1 24.52,70.84 31.73,56.06 41.97,56.11 32.52,57.15 44.81,55.47 43.16,31.8 43.16,26.29 16.72,59.39 21.06,58.72 23.76,54.46 15.65,85.22 23.55,50.55 26.47,49.2 32.29,19.3 35.9,19.41 18.98,62.94 38.21,88.19 38.89,88.19 39.58,88.19 40.27,88.19 44.38,75.87 40.88,87.66 40.88,86.97 40.88,78.71 24.31,93.47 25.51,93.45 27.95,79.04 40.88,76.05 40.88,77.37 44,91.39 43.31,91.39 40.88,76.71 41.94,91.39 38.18,86.23 42.63,91.39 39.53,90.12 39.88,91.39 39.53,90.8 45.73,110.21 40.88,86.28 40.88,85.6 40.88,84.91 40.88,84.23 40.88,83.54 40.88,82.85 40.88,82.17 40.88,81.48 40.88,80.8 40.88,80.11 40.88,79.43 41.64,75.87 42.32,75.87 43.01,75.87 36.15,77.93 43.69,75.87 31.99,77.17 44.69,91.39 45.37,91.39 26.7,79.04 31.58,79.02 27.95,88.32 31.53,88.32 24.49,88.32 24.49,84.18 27.95,84.18 31.53,84.18 35.24,84.18 35.24,88.32 33.33,90.35 29.75,90.35 26.12,90.35 26.12,86.28 29.75,86.28 33.33,86.28 26.12,81.97 29.75,81.97 33.33,81.97 22.56,93.4 36.99,93.42 35.13,93.42 38.31,92.13 36.94,79.04 38.36,80.37 21.22,92.05 21.19,90.4 22.46,79.04 21.29,80.37 27.95,86.28 31.53,86.28 31.53,81.97 27.95,81.97 27.95,90.35 31.53,90.35 35.24,86.28 35.24,81.97 24.49,81.97 24.49,86.28 24.49,90.35 35.24,90.35 25.51,79.04 23.4,75.77 31.73,70.97 41.26,91.39 38.87,90.12 38.21,90.12 19.54,69.9 41.97,62.03 38.08,54.94 39.94,53.72 44.3,52.55 36.28,56.24 12.2,64.24 40.88,78.03 45.07,75.87 45.75,75.87 33.43,62.86 35.46,46.89 29.45,60.55 36.71,30.05 35.97,51.18 39.73,49.73
  pour Top: 47.86,124.69 48.42,124.69 48.42,91.06 40.7,91.06 39.99,90.93 39.96,89.71 41.1,89.69 41.1,76.1 48.42,76.1 48.42,-1.52 -1.87,-1.52 -1.87,124.71
  pour Bottom: -3.65,124.71 -3.65,-1.52 48.42,-1.52 48.42,76.1 41.08,76.1 41.08,89.69 39.99,89.69 39.99,91.06 48.32,91.06 48.42,95.99 48.42,124.71
  pour Top (no thermals): 21.65,46.18 24.67,46.18 24.67,44.65 21.65,44.65
HOLE  (via drill 0.36)
  Top 0.254: IC2.27 29.24,100.28 v29.29,99.92
  Top 0.305: v30.94,96.85 31.61,97.54 R1.2
  Bottom 0.356: v29.29,99.92 30.94,98.27 v30.94,96.85
INT1/DRDY
  Top 0.305: IC7.8 33.81,69.9 33.74,69.9 32.85,69.01 32.85,68 32.57,67.72 31.93,67.72 IC1.44
INT2
  Top 0.305: IC1.43 33.2,66.93 33.53,67.26 33.53,68.55 34.09,69.11 34.67,69.11 IC7.9
MIC  (via drill 0.36)
  Top 0.305: IC1.2 29.37,70.51 30.79,71.93 37.52,71.93 38.36,71.93 38.82,71.48 38.82,70.66 38.82,70.43 38.82,66.19 38.56,65.94 38.56,64.39 | v28.43,37.69 28.47,37.65 C24.1 28.45,36.18 28.45,35.46 28.73,35.18 32.42,35.18 33.32,34.28 R15.2 | IC8.1 28.43,29.56 v28.43,30.58 | 38.56,64.39 38.56,64.92 | v36.96,31.8 39.71,31.8 40.98,33.07 40.98,35.92 44.91,39.85 45.09,40.03 45.09,45.62 45.09,54 41.81,57.28 39.27,57.28 38.56,57.99 38.56,64.39
  Top 0.406: v28.43,37.69 29.57,37.69 TP15.TP
  Bottom 0.305: 28.45,37.67 v28.43,37.69 31.07,37.69 v36.96,31.8
  Bottom 0.406: v28.43,37.69 27.82,37.08 27.82,31.19 v28.43,30.58
MISO  (via drill 0.36)
  Top 0.305: IC1.16 18.03,64.53 17.07,65.48 17.07,80.72 17.68,81.33 v17.76,81.33 | 22.47,87.99 IC6.P$13
  Top 0.356: v18.47,87.78 18.7,88.01 IC6.P$13
  Bottom 0.406: v18.47,87.78 17.76,87.07 v17.76,81.33
MOSI  (via drill 0.36)
  Top 0.305: IC1.15 20.34,65.25 18.34,65.25 17.68,65.91 17.68,78.69 17.68,80.34 18.73,81.38 v18.73,82.45
  Top 0.356: v18.7,84.96 19.35,85.61 IC6.P$15
  Bottom 0.305: 18.7,84.91 v18.7,84.96 | 18.7,82.47 v18.73,82.45
  Bottom 0.406: 18.7,84.91 18.73,84.89 v18.73,82.45
N$1  (via drill 0.36)
  Top 0.305: 16.57,50.7 R4.2 v17.1,50.7 | IC5.7 23.73,46.96 v23.73,48.18
  Bottom 0.406: v17.1,50.7 21.22,50.7 v23.73,48.18
N$2
  Top 0.254: IC3.27 15.83,61.1 R2.2
N$3
  Top 0.254: IC2.25 25.31,97.69 22.99,97.69 9.38,84.07 9.38,70.79 11.42,68.75 IC3.32
N$6
  Top 0.254: IC5.10 22.26,47.7 21.19,48.77 R5.2
  Top 0.305: IC5.10
N$7  (via drill 0.61)
  Top 0.305: JP3.VBUS 36.94,27.46 36.79,27.46
  Top 1.016: 36.79,27.46 35.64,27.46 34.63,28.47 34.63,29.64 34.63,38.2 34.63,40.59 35.25,41.21 | v28.63,40.84 34.91,40.87 35.25,41.21 | 35.25,41.21 37.83,43.79 38.44,44.4 38.44,45.72 39.68,46.96 JP5.4
  Bottom 1.016: D1.A 24.78,40.84 v28.63,40.84
N$8
  Top 0.61: IC6.P$35 37.03,89.18
  Top 0.66: 37.03,89.18 C18.2
N$9
  Top 0.254: IC4.27 32.05,23.34 33.41,23.34 34.02,23.96 R3.2
N$10  (via drill 3.17)
  other vias: 42.58,21.21
N$11  (via drill 3.17)
  other vias: 42.58,50.42
N$12  (via drill 3.17)
  other vias: 42.58,102.44
N$13  (via drill 3.17)
  other vias: 42.58,73.28
N$14
  Top 0.406: C21.2 R12.2
N$15
  Top 0.406: R11.1 C21.1 25.09,34.49 22.59,34.49 20.26,36.82 MIC1.1
N$16
  Top 0.305: 31.54,30 C22.2 30.86,30.1 IC8.3
  Top 0.406: R13.1 C22.2 R14.1
N$17  (via drill 0.36)
  Top 0.305: R15.1 R12.1 v29.7,34.16 | IC8.4 29.82,32.16 v29.8,32.18 | C24.2 v29.7,36.19
  Bottom 0.406: v29.7,36.19 v29.7,34.16 29.7,32.28 v29.8,32.18
N$18
  Bottom 0.254: 44.18,35.33 43.92,35.58 43.67,35.58 43.41,35.33 43.41,35.08 44.18,34.31 44.94,35.08 44.94,35.33 44.68,35.58 44.43,35.58 44.18,35.33
N$19
  Top 0.254: IC4.32 24.98,26.59 21.7,26.59 14.13,34.16 12.63,34.16 9.28,37.52 9.28,53.01 11.42,55.15 IC3.25
N$20
  Top 0.406: R10.2 24.59,36.19 22.76,36.19 MIC1.2
N$21
  Top 0.406: IC6.P$6 TP13.P$1
N$22
  Top 0.66: C18.1 L2.2 41.42,89.19 C17.2
N$23
  Top 0.406: IC6.P$8 26.73,92.08 TP14.P$1
N$24
  Top 0.305: IC9.2 30.54,49.09 30.13,49.5 27.31,49.5 27.31,49.12 27.36,49.07 31.2,49.07 30.26,49.07 arc-90 30.08,49.25 27.54,49.25 arc90 27.51,49.22 30.16,49.22 arc90 30.41,49.48 30.99,49.15 L3.2
N$25
  Top 0.61: 45.22,87.49 arc90 ANT.P$1 45.24,88.01 arc90 44.06,89.19 L1.2
  Top 0.66: C17.1 L1.2
N$26
  Top 0.406: IC6.P$30 37.05,83.16 38.77,83.16 38.88,83.05 SJ1.1
N$27
  Top 0.406: IC6.P$29 37.13,82.15 SJ1.2
N$28
  Top 0.406: IC6.P$28 35,80.22 SJ2.2
N$29
  Top 0.406: IC6.P$27 34.1,80.21 SJ2.1
N$30
  Top 0.305: IC9.4 31.1,48.09 30.13,47.12 27.31,47.12 27.31,48.03 27.31,48.08 31.07,48.08 27.51,48.08 27.51,47.4 30.21,47.4 30.66,47.85 27.79,47.85 27.72,47.78 27.72,47.62 27.74,47.6 30.21,47.6 30.23,47.62 30.15,47.62 L3.1
N$32
  Top 0.305: IC9.8 36.39,48.59 C29.2 36.32,48.09 IC9.7 | IC9.6 36.15,47.59 R8.1
  Top 1.016: R8.1 C29.2
N$33
  Top 0.254: 44.79,118.29 46.01,118.29
N$36
  Top 0.305: IC1.36 32.81,61.33 32.82,61.34 33.43,60.73 33.43,58.29 34.19,57.53 C3.2 34.77,57.73 35.03,57.73 36.26,58.97 X1.3
N$37
  Top 0.305: IC1.37 33.31,62.13 34.02,61.42 34.66,61.42 X1.1 34.66,63.02 C4.2
N$39
  Bottom 0.254: 42.73,117.47 44.79,118.29 46.01,118.29
RST  (via drill 0.36)
  Top 0.305: IC1.35 31.89,60.5 30.77,60.5 29.75,61.52 v29.37,61.52
  Top 0.406: v24.54,64.87 24.54,63.78 v25.56,62.76 | v12.91,81.43 12.91,78.18 JP1.3
  Bottom 0.305: v25.56,62.76 26.8,61.52 v29.37,61.52 30.26,61.52 31.88,59.89 31.88,56.87 36.61,52.15 36.61,44.27 36.61,40.54 RST.2 | S1.3 12.96,82.57 12.91,82.52
  Bottom 0.406: JP1.3 17.05,76.48 18.24,75.29 18.24,67.64 19.16,66.73 22.69,66.73 v24.54,64.87 | 12.91,82.52 v12.91,81.43
SCK
  Top 0.305: IC1.17 17.81,63.73 16.49,65.05 16.49,81.48 18.22,83.21 IC6.P$17
  Top 0.406: 22.47,83.24 IC6.P$17
SCL/SPC
  Top 0.305: IC1.41 33.43,65.33 33.99,65.89 34.69,65.89 IC7.13
SCLK  (via drill 0.36)
  Top 0.254: IC3.31 12.78,63.1 12.78,63.12 13.09,63.42 v14.28,63.42 16.01,63.42 17.56,61.87 v17.56,60.58 17.56,59.11 15.86,57.4 10.85,52.4 10.85,38 13.29,35.56 14.89,35.56 22.03,28.42 25.69,28.42 29.06,25.04 29.06,23.18 IC4.31 | IC2.31 30,102.37 30,102.34 30.31,102.03 31.12,102.03 31.63,101.52 31.63,100.46 arc-90 29.88,98.78 29.47,98.78 26.88,96.19 23.73,96.19 11.11,83.57 11.11,71.63 12.6,70.13 14.08,68.66 v14.08,67.56 | TP10.TP arc90 v39.4,59.36 TP3.TP | TP12.TP TP8.TP | TP8.TP TP3.TP | TP3.TP 39.27,59.36 v39.27,60.65 | TP3.TP TP8.TP
  Top 0.305: IC1.21 17.61,60.53 v17.56,60.58
  Top 0.406: v39.27,60.65 39.27,59.71 39.63,59.71 TP10.TP
  Bottom 0.254: v17.56,60.58 arc-90 17.61,60.63 | TP7.TP TP8.TP v39.4,59.36
  Bottom 0.305: 39.27,60.07 39.27,62.08 37.29,64.06 25.71,64.06 22.18,60.53 17.61,60.53 | 17.61,60.53 v17.56,60.58 17.61,60.53 | TP8.TP 41.51,59.84 39.5,59.84
  Bottom 0.406: TP10.TP 39.5,59.84 39.27,60.07 v39.27,60.65 | v14.08,67.56 14.2,67.44 14.2,63.96 14.2,63.5 arc90 v14.28,63.42
SDA/SDI/SDO
  Top 0.305: IC1.42 33.39,66.13 33.94,66.67 34.67,66.67 IC7.12
SDO
  Top 0.305: IC1.40 33.57,64.53 33.81,64.77 35.16,64.77 35.69,65.3 IC7.14
SELECT
  Top 0.406: IC1.6 26.17,70.84 27.39,72.06 29.19,72.06 30.26,73.13 32.21,73.13 32.47,73.38 JP4.3
SIN  (via drill 0.36)
  Top 0.254: IC2.32 30.54,102.92 31.07,102.92 32.16,101.83 32.16,100.74 arc-90 30,98.35 27.34,95.68 23.96,95.68 11.69,83.41 11.69,71.91 14.71,68.88 14.98,68.62 14.98,66.97 14.98,65.47 18.24,62.2 v18.24,61.34
  Top 0.305: IC1.20 20.41,61.34 v18.24,61.34
  Bottom 0.254: TP5.TP TP6.TP | TP5.TP TP11.TP | TP5.TP 43.02,64.57 43.02,64.55
  Bottom 0.305: TP6.TP 25.36,64.57 22.13,61.34 v18.24,61.34
  Bottom 0.406: 40.04,65.32 TP6.TP
SOUT
  Top 0.254: 44.84,65.25 44.74,65.25 TP9.TP TP1.TP TP2.TP
  Top 0.406: 42.22,64.39 TP1.TP 42.07,64.54 45.37,64.54 45.75,64.16 45.75,63.94 45.75,44.75 45.75,39.6 42.14,35.99 42.14,25.58 42.14,25.55 42.14,24.59 37.75,20.17 36.73,20.17 31.43,20.17 30.87,20.72 IC4.25
SPI_IRQ  (via drill 0.36)
  Top 0.305: IC1.12 20.63,67.94 v20.66,82.52
  Top 0.356: v20.68,86.59 20.91,86.81 IC6.P$14
  Bottom 0.406: v20.68,86.59 20.66,86.56 v20.66,82.52
SS  (via drill 0.36)
  Top 0.305: 22.46,89.18 IC6.P$12 | IC1.14 20.41,66.12 18.83,66.12 18.34,66.6 18.34,77.6 18.34,80.11 19.67,81.43 v19.67,81.97
  Top 0.356: v19.69,88.95 19.95,89.21 IC6.P$12
  Bottom 0.305: 19.69,81.99 v19.67,81.97
  Bottom 0.406: v19.69,88.95 19.67,88.92 v19.67,81.97
STAT  (via drill 0.36)
  Top 0.406: v19.06,51.99 19.06,51.42 R4.1 | IC1.4 27.77,63.65 v24.85,60.73
  Bottom 0.406: v24.85,60.73 24.03,59.92 24.03,56.97 v19.06,51.99
UP
  Top 0.406: IC1.5 26.97,70.75 27.67,71.45 29.44,71.45 30.51,72.52 33.92,72.52 35.01,73.61 JP4.4
VBAT_SW_EN  (via drill 0.36)
  Top 0.305: 22.17,68.16 v22.15,68.15
  Top 0.406: IC1.11 22.17,68.16 | IC6.P$26 32.75,78.92 v32.77,78.89
  Bottom 0.406: v22.15,68.15 23.55,66.75 27.69,66.75 29.09,68.15 30.31,69.37 32.95,69.37 37.09,73.51 37.09,75.56 33.76,78.89 v32.77,78.89
VCC  (via drill 0.36, 0.61)
  Top 0.254: v30.18,100.05 IC2.28 | IC4.28 29.81,21.78 | 29.81,21.78 | SLOT1.P$1 42.4,9.78 | 41.87,9.78 41.99,9.78 | IC3.28 15.35,61.6 v16.03,62.28 | 23.25,42.93 IC5.3 | IC5.3 | IC5.3 23.42,43.66 23.42,43 23.58,43.16 23.58,43.66 23.25,43.33 23.25,42.72 | 26.6,44.09 26.78,43.92
  Top 0.305: v14.89,64.29 14.62,64.56 C9.1 | v33.61,99.42 32.94,98.77 C11.1 | C10.1 32.99,24.99 IC4.28 | IC5.3 IC5.4 | IC5.3 | 23.42,43 23.48,43 23.32,42.85 23.27,42.85 23.27,42.44 23.73,42.9 23.73,43.48 23.73,42.62 23.96,42.62 | 24.92,41.66 24.92,42.24 24.97,42.24 | 27.01,43.23 26.55,42.24 26.73,42.24 | 29.44,42.96 28.06,43.52 | v18.55,59.64 18.55,58.8 v15.47,55.73 | IC9.5 31.65,47.22 | C26.1 31.65,45.52 31.65,43.79
  Top 0.406: IC6.P$19 24.35,79.77 24.36,79.98 | R6.1 24.5,49.77 26.22,48.06 26.22,43.36 26.17,43.31 | C10.1 33.02,25.02 33.69,25.68 34.85,25.68 35.69,24.84 v35.69,24.26
  Top 0.61: 24.36,79.98 24.36,79.45 24.36,78.07 C19.2 23.53,77.85 arc90 v23.48,77.8
  Top 0.813: C13.A 27.01,43.23 | 32.84,43.92 32.85,43.92 | 32.79,43.92 32.85,43.92 | 32.85,43.92 arc-90 32.77,43.99
  Top 1.016: 26.17,43.2 26.17,43.31 arc-90 25.48,42.62 23.96,42.62 arc90 24.31,42.27 | v11.77,38.56 21.8,38.56 24.9,41.66 24.92,41.66 | 31.65,47.22 31.65,43.79 31.65,43.23 VCC.1 | 34.75,43.26 34.75,43.47 R8.2
  Top 1.27: v44.35,8.36 SLOT1.P$1 42.2,9.78 | 42.2,9.78 41.99,9.78 42.2,9.78 | 42.2,9.78 41.87,9.78 v39.96,9.78 38.08,11.73 v39.48,16.15 | VCC.2 34.75,43.26 arc-90 34.27,43.92 32.85,43.92 26.78,43.92 arc90 26.17,43.31 | 26.17,43.2 26.17,42.27 arc90 26.19,42.24 26.73,42.24 | 26.73,42.24 34.12,42.24 arc90 34.3,42.42 33.64,43.08 28.45,43.08 28.06,43.52 27.34,42.8 26.73,42.24 | 26.73,42.24 24.97,42.24 24.95,42.27 23.76,42.27
  Bottom 0.254: 44.33,9.75 SLOT1.P$1 | v44.35,8.36 44.3,8.36 | 16.06,62.25 v16.03,62.28 | 9.35,55.93 9.28,55.93 C14.A
  Bottom 0.305: 4.43,70.84 3.99,70.8 LED8.A | v15.47,55.73 15.13,55.38 C15.1
  Bottom 0.356: 26.75,107.44 26.75,103.4 29.75,100.41 v30.18,100.05 30.82,99.42 v33.61,99.42
  Bottom 0.406: 42.07,118.24 LED1.A | 22.21,103.25 22.31,103.35 | 9.31,83.05 9.1,82.57 | 7.38,77.15 7.22,76.66 | 9.33,40.21 9.3,40.22 | v35.69,24.26 35.72,24.28 | v14.89,64.29 16.03,63.14 v16.03,62.28 16.74,61.57 16.74,60.48 16.74,60.4 17.51,59.64 v18.55,59.64
  Bottom 0.61: 37.12,114.17 LED4.A | 31.71,111.12 LED7.A | 26.75,107.44 LED10.A | LED13.A 22.21,103.25 20.85,101.63 | 18.22,98.53 LED16.A | 14.76,93.45 LED19.A | 11.54,88.16 LED22.A | 9.1,82.57 LED2.A | 7.22,76.66 LED5.A | 6,70.41 3.99,70.8 | 5.44,64.57 LED11.A | 6.15,52.12 LED17.A | 7.4,46.02 LED20.A | LED23.A 9.33,40.21 9.21,40.46 | 11.77,34.72 LED3.A | 15.04,29.34 LED6.A | 18.8,24.36 LED9.A | 23.07,19.84 LED12.A | 27.69,15.7 LED15.A | 32.75,12.17 LED18.A | 38.06,9.09 LED21.A | C14.A 11.28,55.85 11.74,55.4 C16.1 C15.1 | 10.39,85.53 12.91,85.53 12.96,85.57 14.64,83.9 14.64,81.94 16.19,80.39 18.75,80.39 21.34,77.8 v23.48,77.8
  Bottom 0.813: 9.21,40.46 7.4,46.02 6.15,52.12 5.29,58.17 5.44,64.57 6,70.41 6.17,71 7.38,77.15 8.29,79.94 9.31,83.05 10.39,85.53 11.54,88.16 14.76,93.45 18.22,98.53 22.31,103.35 26.75,107.44 30.57,110.28 31.71,111.12 37.12,114.17 41.89,116.74 42.07,118.24 | 9.3,40.22 11.77,34.72 15.04,29.34 18.8,24.36 23.07,19.84 27.69,15.7 | 27.69,15.7 32.75,12.17 38.06,9.09 43.64,6.68 | 27.69,15.7 v35.69,24.26 | 35.72,24.28 39.43,24.28
  Bottom 1.016: LED14.A 5.29,58.17 7.75,58.17 arc-90 9.35,56.57 9.35,55.93 | 10.47,37.92 v11.77,38.56
  Bottom 1.27: LED24.A 43.64,6.68 44.33,7.26 44.33,8.33 44.33,9.75 | 34.4,39.06 34.4,38.68 | v39.96,9.78 42.2,9.78 SLOT1.P$1 | 34.4,37.36 36.94,34.82 39.48,32.28 39.48,21.74 | 39.48,21.74 39.48,19.91 39.48,16.36 v39.48,16.15 | 39.48,21.74 39.48,22.28 | 34.4,37.36 34.4,38.68 | 34.4,38.68 34.4,43.08 arc90 VCC.2 33.41,43.23 33.41,43.08 31.76,43.08 31.76,43.92 34.14,43.92 34.07,43.92 34.07,42.24 31.71,42.24 VCC.1 | 34.4,37.36 34.4,38.68
VIO  (via drill 0.36)
  Top 0.305: IC1.10 | 23.32,73.23 v23.27,73.2
  Top 0.406: IC1.10 22.97,72.87 23.32,73.23 | IC6.P$23 29.15,79.69 29.14,79.69 v29.14,78.89 29.1,78.86 C25.2
  Bottom 0.406: 29.11,78.87 v29.14,78.89
  Bottom 0.61: v23.27,73.2 28.96,78.89 v29.14,78.89
WL_EN1
  Top 0.254: SJ3.1 SJ3.2
  Top 0.406: SJ3.1 27.95,94 IC6.P$7 | IC6.P$5 30.35,93.94 SJ3.2
XLAT  (via drill 0.36)
  Top 0.254: IC2.26 28.66,100.16 28.66,99.8 26.04,97.18 23.27,97.18 9.94,83.84 9.94,71.07 12.12,68.88 v12.12,68.25 | IC3.26 12.55,60.6 v12.53,60.38 12.53,55.5 9.84,52.81 9.84,37.62 12.83,34.62 14.41,34.62 21.93,27.1 v26.04,27.1 | v31.53,21.82 31.24,21.82 IC4.26 | 43.44,12.32 SLOT1.P$2
  Top 0.406: v31.53,21.82 31.93,21.41 v34.35,21.41 | v18.04,56.95 19.07,57.98 IC1.23
  Top 0.813: v42.58,13.18 43.44,12.32
  Bottom 0.254: 43.44,12.32 SLOT1.P$2
  Bottom 0.406: v42.58,13.18 40.47,13.18 35.16,18.49 35.16,20.6 v34.35,21.41 | v26.04,27.1 31.32,21.82 v31.53,21.82 | v18.04,56.95 14.33,56.95 12.53,58.75 v12.53,60.38 12.53,63.4 12.99,63.86 12.99,66.19 12.12,67.06 v12.12,68.25
  Bottom 0.813: v42.58,13.18 43.44,12.32

## Text on the board
Top: M
Bottom: Bo
tPlace: GND | BLANK | GND | charliex / mmca / krs | 3V3 | RST | PDI | GND | OUTPUT | nullspacelabs.com | SCLK | IC9 | PWR | + | D- | USB | D+ | Mic | GND | RST | XLAT | v5.0 | VCC
bPlace: GND | BLANK | Reset | INPUT | SCLK | D1 | Mode | XLAT | VCC
tStop: M